# EasyEDA Pro project DRV8701驱动（最终）.eprj

# Schematic 20250211
Board Name: 20250211; Create Date: 2025-03-03; Page Name: Sheet_1; Project Name: DRV8701驱动（最终）; Schematic Name: 20250211; Update Date: 2025-03-03; Add into BOM: yes; Company: Your Company; Convert to PCB: yes; Date: 2021-11-28; Draw By: nhyxx; REV: 1.0; Sheet: 1/1
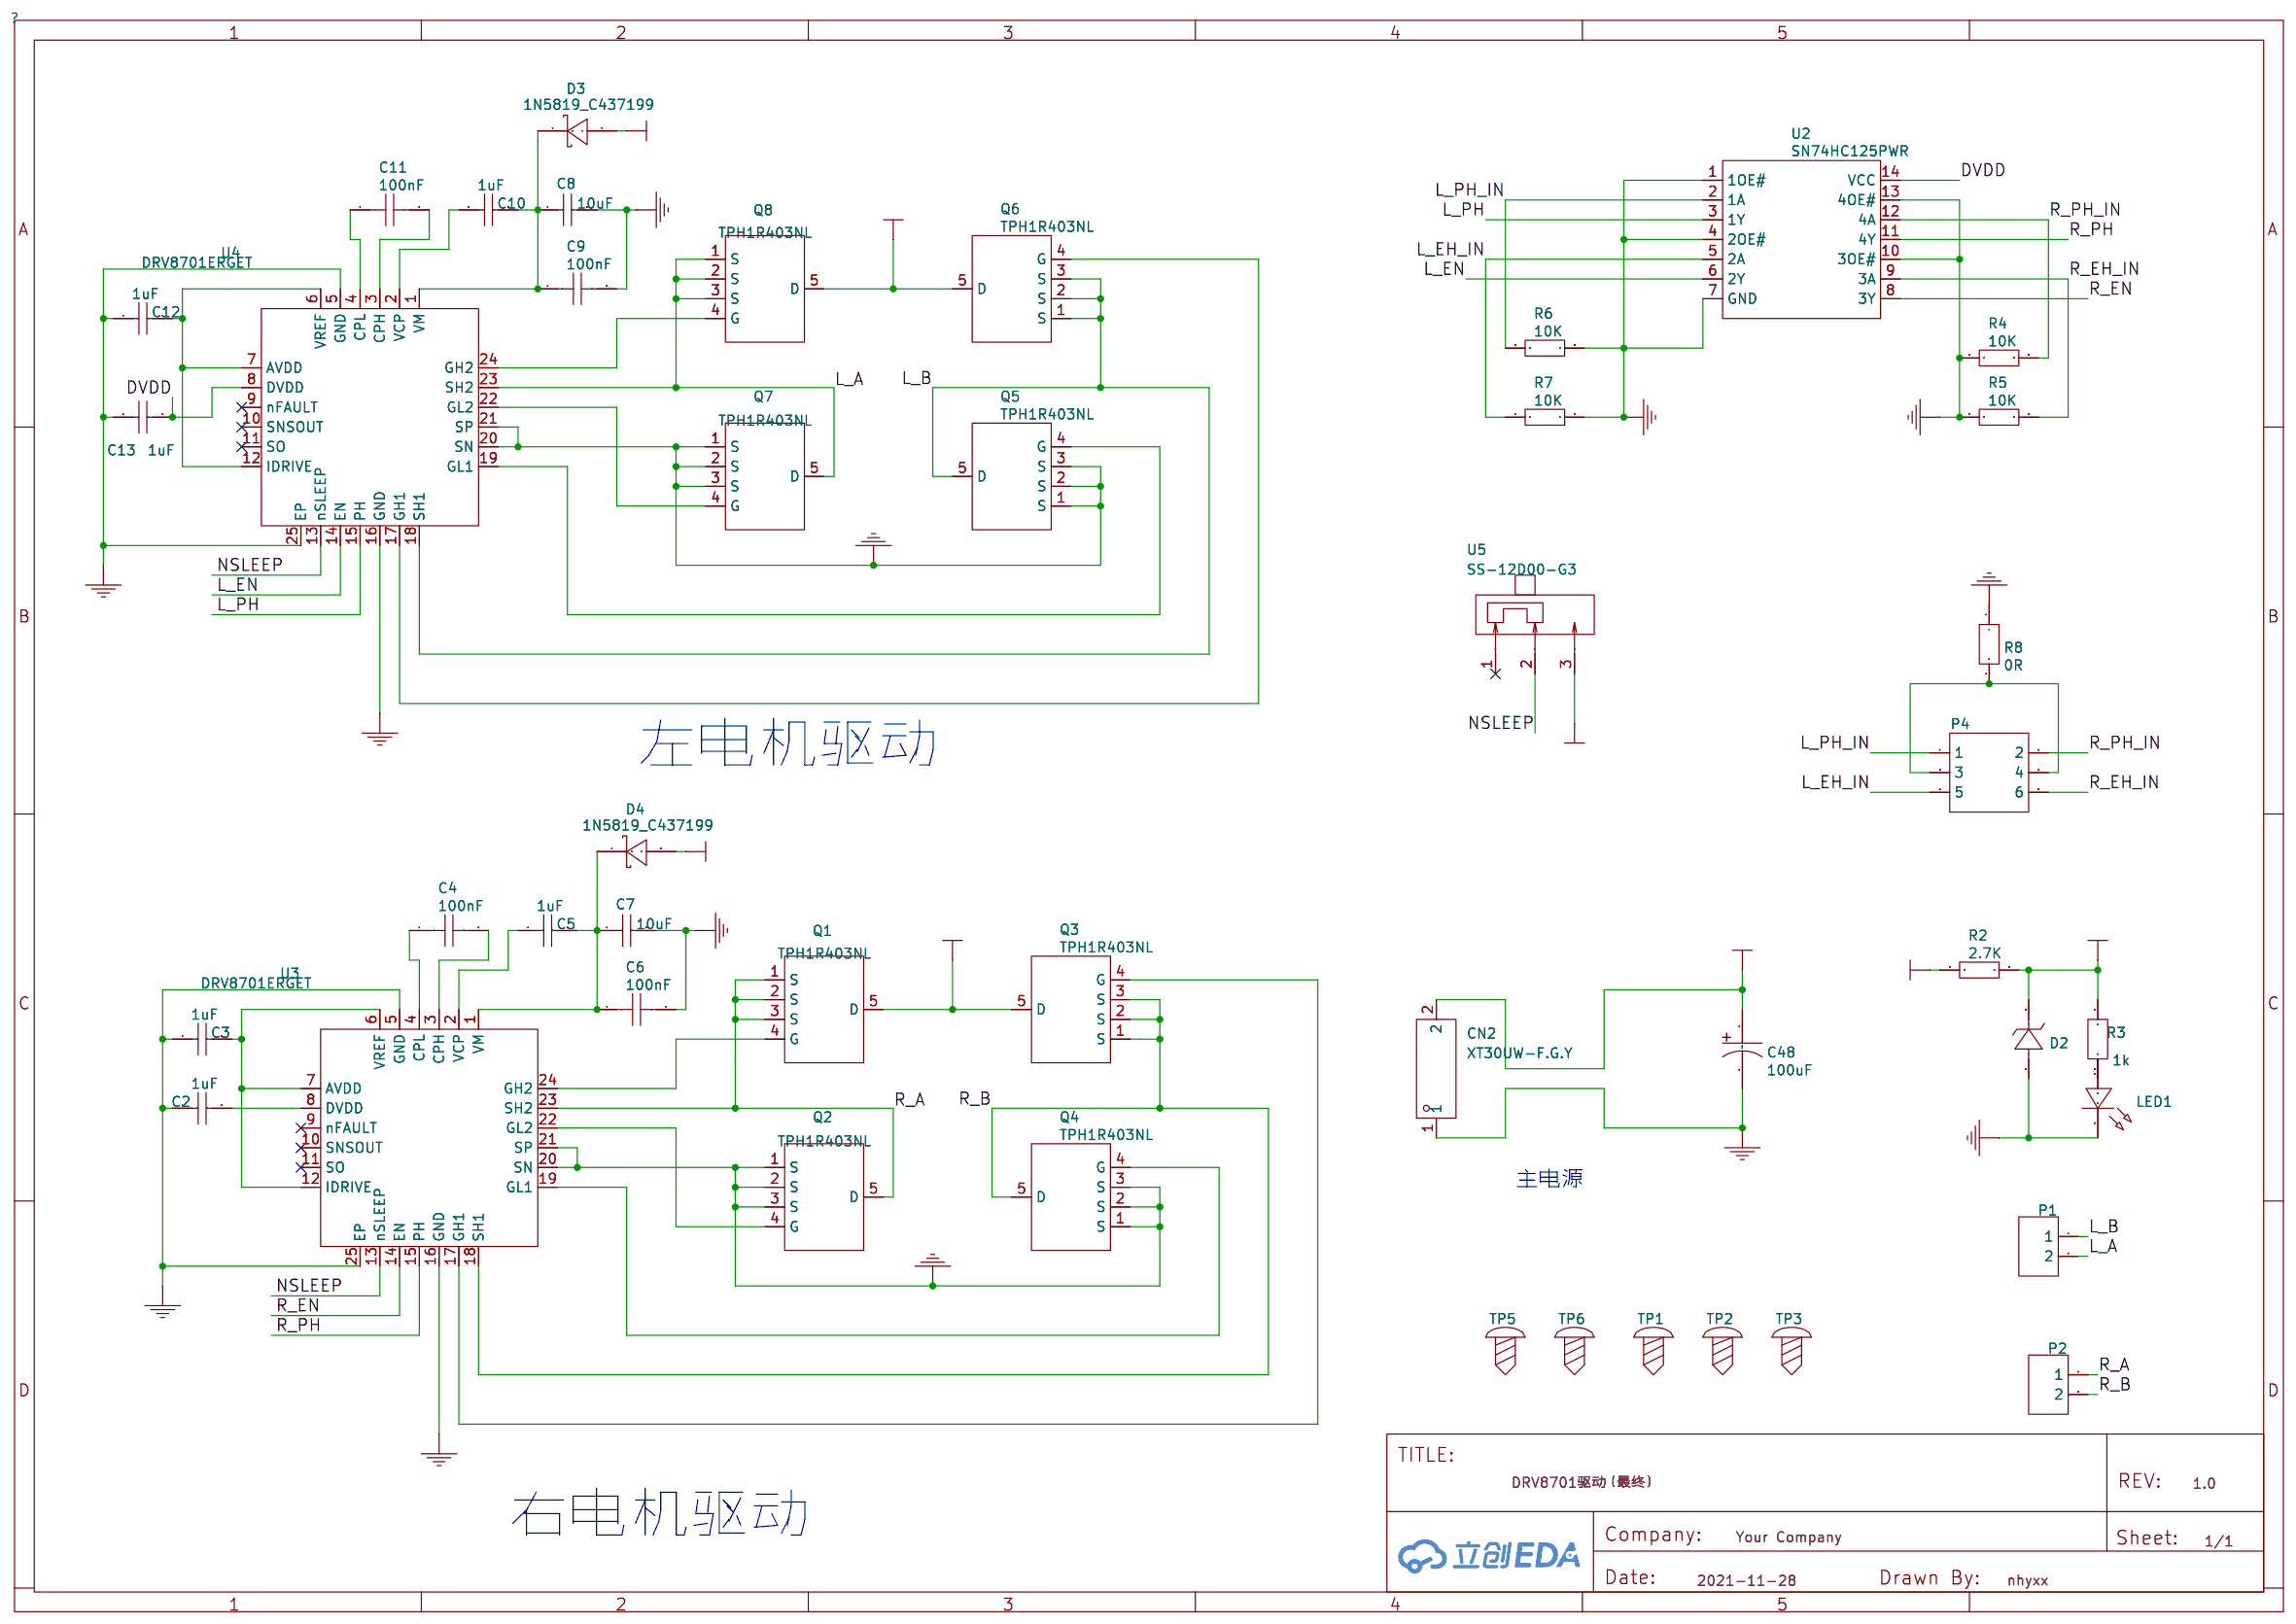
[diagram p0: schematic sheet]

## Parts
C2  1uF  [C0603]
C3  1uF  [C0603]
C4  100nF  [C0603]
C5  1uF  [C0603]
C6  100nF  [C0603]
C7  10uF  [C0603]
C8  10uF  [C0603]
C9  100nF  [C0603]
C10  1uF  [C0603]
C11  100nF  [C0603]
C12  1uF  [C0603]
C13  1uF  [C0603]
C48  100uF  [CAP-TH_BD8.0-P3.50-D1.0-FD]
CN2  XT30UW-F.G.Y  [CONN-TH_XT30UW-F.G.Y]
D2  BZT52C3V3_C908185  [SOD-123_L2.7-W1.6-LS3.7-RD]
D3  1N5819_C437199  [SMA_L4.4-W2.6-LS5.0-RD]
D4  1N5819_C437199  [SMA_L4.4-W2.6-LS5.0-RD]
LED1  LED-0805_R  [LED0603_BLUE]
P1  CONN-TH_2P-P5.00  [CONN-TH_2P-P5.00]
P2  CONN-TH_2P-P5.00  [CONN-TH_2P-P5.00]
P4  -  [HDR-TH_6P-P2.54-V-F-R2-C3-S2.54]
Q1  TPH1R403NL  [POWERVDFN-8_L6.2-W5.2-P1.27-LS6.0-BL]
Q2  TPH1R403NL  [POWERVDFN-8_L6.2-W5.2-P1.27-LS6.0-BL]
Q3  TPH1R403NL  [POWERVDFN-8_L6.2-W5.2-P1.27-LS6.0-BL]
Q4  TPH1R403NL  [POWERVDFN-8_L6.2-W5.2-P1.27-LS6.0-BL]
Q5  TPH1R403NL  [POWERVDFN-8_L6.2-W5.2-P1.27-LS6.0-BL]
Q6  TPH1R403NL  [POWERVDFN-8_L6.2-W5.2-P1.27-LS6.0-BL]
Q7  TPH1R403NL  [POWERVDFN-8_L6.2-W5.2-P1.27-LS6.0-BL]
Q8  TPH1R403NL  [POWERVDFN-8_L6.2-W5.2-P1.27-LS6.0-BL]
R2  2.7K  [R0603]
R3  1k  [R0603]
R4  10K  [R0603]
R5  10K  [R0603]
R6  10K  [R0603]
R7  10K  [R0603]
R8  0R  [R1206]
TP1  M3铜柱  [M3铜柱]
TP2  M3铜柱  [M3铜柱]
TP3  M3铜柱  [M3铜柱]
TP5  M3铜柱  [M3铜柱]
TP6  M3铜柱  [M3铜柱]
U2  SN74HC125PWR  [TSSOP-14_L5.0-W4.4-P0.65-LS6.5-BL]
U3  DRV8701ERGET  [VQFN-24_L4.0-W4.0-P0.50-LS4.0-BL-EP]
U4  DRV8701ERGET  [VQFN-24_L4.0-W4.0-P0.50-LS4.0-BL-EP]
U5  SS-12D00-G3  [SW-TH_3P-L8.8-W3.9-P2.50_SS12D00G3]

## Library data of the parts
C2 C3 C5 C10 C12 C13 = 1uF: Supplier: LCSC; Manufacturer Part: CL21F105ZOFNNNE; Manufacturer: SAMSUNG; Supplier Part: C16834
C4 C6 C9 C11 = 100nF: Supplier: LCSC; Supplier Part: C730459; Manufacturer: Samsung Electro-Mechanics; Manufacturer Part: CL21B104MBCNNNC
C7 C8 = 10uF: Supplier: LCSC; Supplier Part: C329933; Manufacturer: TDK; Manufacturer Part: C2012X5R1E106KT000N
C48 = 100uF: Supplier: LCSC; Supplier Part: C171434; Manufacturer: Aihua Group; Manufacturer Part: SPZ1HM101F09O00RAXXX; Paste Type: expand
CN2 = XT30UW-F.G.Y: LCSC Part Name: XT30UW防水锁扣镀金15A二芯母插头; Supplier Part: C19268025; Manufacturer: AMASS(艾迈斯); JLCPCB Part Class: 扩展库; Datasheet: https://atta.szlcsc.com/upload/public/pdf/source/20231221/78A47C12D57CEEC1F37EAB36F210ACCA.pdf; Supplier: LCSC
D2 = BZT52C3V3_C908185: Supplier: LCSC; Supplier Part: C908185; Manufacturer: FUXINSEMI; Manufacturer Part: BZT52C3V3
D3 D4 = 1N5819_C437199: Supplier: LCSC; Supplier Part: C437199; Manufacturer: KEXIN; Manufacturer Part: 1N5819; JLCPCB Part Class: Extend; JLCPCB SMD: Yes
LED1 = LED-0805_R: Manufacturer: EVERLIGHT(台湾亿光); Manufacturer Part: 17-21SURC/S530-A3/TR8; Supplier Part: C72037
P1 P2 = CONN-TH_2P-P5.00: Supplier: LCSC
P4 = HDR-F_2.54_2x3: Supplier Part: C92272; Supplier Footprint: 插件
Q1-Q8 = TPH1R403NL: Supplier: LCSC; Manufacturer: TOSHIBA; Supplier Part: C83440; JLCPCB Part Class: Extend; JLCPCB SMD: Yes
R2 = 2.7K: Supplier: LCSC; Manufacturer: UniOhm; Manufacturer Part: 0805W8F2701T5E; Supplier Part: C17530; JLCPCB Part Class: Basic; JLCPCB SMD: Yes
R3 = 1k
R4-R7 = 10K: Supplier: LCSC; Supplier Part: C328719; Manufacturer: SUSUMU; Manufacturer Part: RG2012P-103-B-T5
R8 = 0R
TP1-TP3 TP5 TP6 = M3铜柱
U2 = SN74HC125PWR: Supplier: LCSC; Supplier Part: C132994; Manufacturer: Texas Instruments; JLCPCB Part Class: Extend; JLCPCB SMD: Yes
U3 U4 = DRV8701ERGET: Supplier: LCSC; Manufacturer: TI; Supplier Part: C132049; JLCPCB Part Class: Extend; JLCPCB SMD: Yes
U5 = SS-12D00-G3: 操作正拨 插件立式 尺寸大型 两档位; Supplier Part: C22355741; Manufacturer: SOFNG(硕方); Supplier Footprint: 插件-3P,8.8x3.9mm; JLCPCB Part Class: 扩展库; Datasheet: https://atta.szlcsc.com/upload/public/pdf/source/20240529/1037A069FE9BBCECE56007AB916D4384.pdf; Supplier: LCSC

## Nets
3V3: D2.1(K) R2.2 R3.1 U5.3
DVDD: C13.2 U2.14(VCC) U4.8(DVDD)
GND: C2.1 C3.1 C6.2 C7.2 C8.2 C9.2 C12.1 C13.1 C48.2 CN2.1 D2.2(A) LED1.2 Q2.1(S) Q2.2(S) Q2.3(S) Q4.1(S) Q4.2(S) Q4.3(S) Q5.1(S) Q5.2(S) Q5.3(S) Q7.1(S) Q7.2(S) Q7.3(S) R4.1 R5.1 R6.2 R7.2 R8.1 U2.1(1OE#) U2.4(2OE#) U2.7(GND) U2.10(3OE#) U2.13(4OE#) U3.5(GND) U3.16(GND) U3.20(SN) U3.21(SP) U3.25(EP) U4.5(GND) U4.16(GND) U4.20(SN) U4.21(SP) U4.25(EP)
L_A: P1.2 Q7.5(D) Q8.1(S) Q8.2(S) Q8.3(S) U4.23(SH2)
L_B: P1.1 Q5.5(D) Q6.1(S) Q6.2(S) Q6.3(S) U4.18(SH1)
L_EH_IN: P4.5 R7.1 U2.5(2A)
L_EN: U2.6(2Y) U4.14(EN)
L_PH: U2.3(1Y) U4.15(PH)
L_PH_IN: P4.1 R6.1 U2.2(1A)
NSLEEP: U3.13(nSLEEP) U4.13(nSLEEP) U5.2
R_A: P2.1 Q1.1(S) Q1.2(S) Q1.3(S) Q2.5(D) U3.23(SH2)
R_B: P2.2 Q3.1(S) Q3.2(S) Q3.3(S) Q4.5(D) U3.18(SH1)
R_EH_IN: P4.6 R5.2 U2.9(3A)
R_EN: U2.8(3Y) U3.14(EN)
R_PH: U2.11(4Y) U3.15(PH)
R_PH_IN: P4.2 R4.2 U2.12(4A)
VM: C48.1 CN2.2 D3.2(A) D4.2(A) Q1.5(D) Q3.5(D) Q6.5(D) Q8.5(D) R2.1
$1N18: Q8.4(G) U4.24(GH2)
$1N20: Q7.4(G) U4.22(GL2)
$1N30: Q5.4(G) U4.19(GL1)
$1N31: Q6.4(G) U4.17(GH1)
$1N38: C12.2 U4.6(VREF) U4.7(AVDD) U4.12(IDRIVE)
$1N40: C11.1 U4.4(CPL)
$1N41: C11.2 U4.3(CPH)
$1N42: C10.1 U4.2(VCP)
$1N43: C8.1 C9.1 C10.2 D3.1(C) U4.1(VM)
$1N47: C5.2 C6.1 C7.1 D4.1(C) U3.1(VM)
$1N49: C5.1 U3.2(VCP)
$1N50: C4.2 U3.3(CPH)
$1N51: C4.1 U3.4(CPL)
$1N53: C3.2 U3.6(VREF) U3.7(AVDD) U3.12(IDRIVE)
$1N54: C2.2 U3.8(DVDD)
$1N59: Q3.4(G) U3.17(GH1)
$1N61: Q4.4(G) U3.19(GL1)
$1N70: Q2.4(G) U3.22(GL2)
$1N71: Q1.4(G) U3.24(GH2)
$1N75: LED1.1 R3.2
$1N2212: P4.3 P4.4 R8.2

Not connected (* = marked no-connect by the designer): U3 9(nFAULT)* 10(SNSOUT)* 11(SO)*; U4 9(nFAULT)* 10(SNSOUT)* 11(SO)*; U5 1*

## Notes on the sheet
- 左电机驱动
- 主电源
- 右电机驱动

# Board PCB_2-12
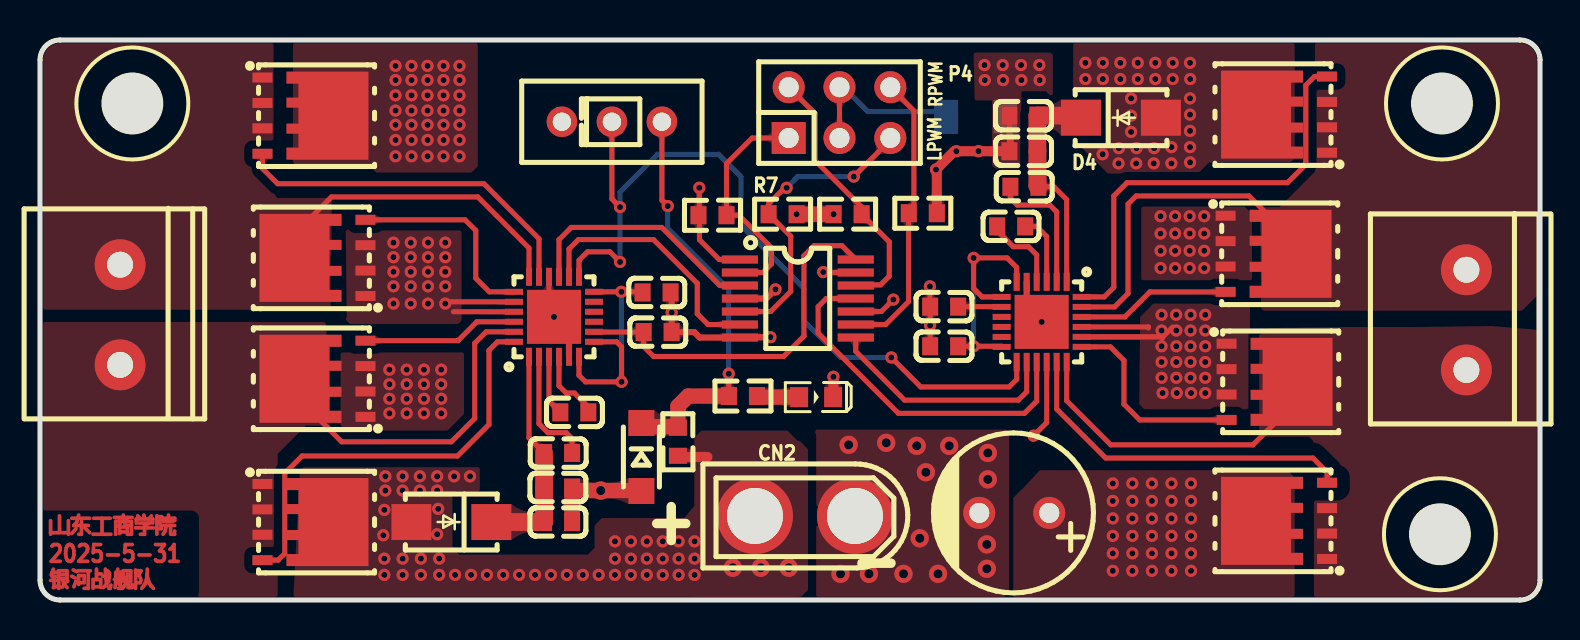
[diagram p1: board, top side]
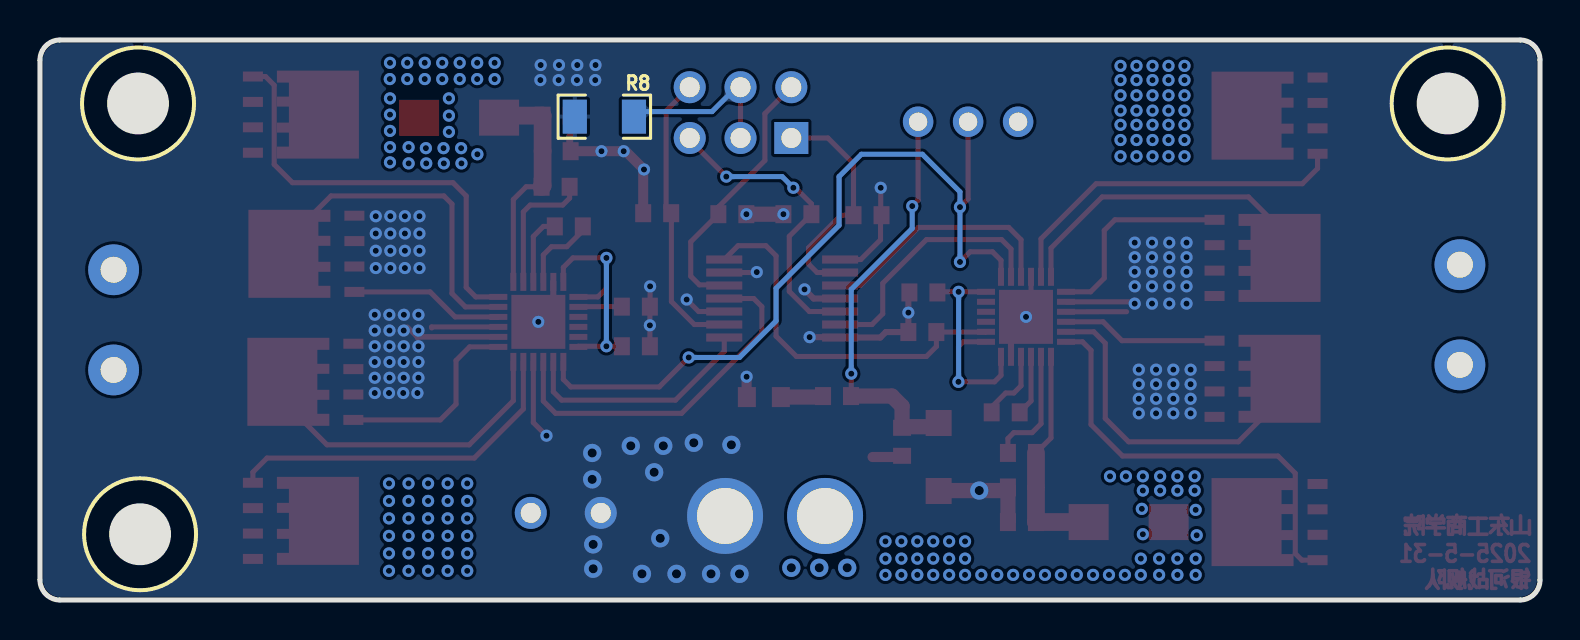
[diagram p2: board, bottom side, seen from below]

Outline 75 x 28 mm; copper layers: Top Layer, Inner1, Inner2, Bottom Layer. Coordinates in mm from the lower left corner of the outline.
Outline path: 0,27 0,1 arc(0.29,0.29) 1,0 74,0 arc(74.71,0.29) 75,1 75,27 arc(74.71,27.71) 74,28 1,28 arc(0.29,27.71) 0,27
Stack: Top Layer 0.035mm / Dielectric1 0.48mm PP er 4.5 / Inner1 0.035mm / Dielectric2 0.48mm FR4 er 4.5 / Inner2 0.035mm / Dielectric3 0.48mm PP er 4.5 / Bottom Layer 0.035mm

## Design rules (mm)
spacing Default (default): track to track 0.152, other pairs 0 to 0.152
track width Default (default): min 0.254, default 0.254, max 25.4
differential pair differentialPair (default): width min 0.127, default 0.254, max 2.54; gap min 0.152, default 0.152
via Default (default): diameter min 0.61, default 0.61, max 100.025; hole min 0.305, default 0.305, max 59.995
pour e34 uses gge43599
pour e36 uses gge43605
pour e38 uses gge43593
pour e435 uses gge4859
pour e437 uses gge4979
pour e439 uses gge5889
pour e441 uses gge6201
pour e443 uses gge6205
pour e445 uses gge6367
pour e447 uses gge6451
pour e449 uses gge6710
pour e451 uses gge7214
pour e453 uses gge8108
pour e455 uses gge8115
pour e457 uses gge17115
pour e459 uses gge17680
pour e461 uses gge18781
pour e466 uses gge43533

## Placement (name value [footprint] x y rotation side)
C2  1uF  [C0603]  45.21 14.67 0 top
C3  1uF  [C0603]  45.21 12.69 0 top
C4  100nF  [C0603]  48.56 18.68 0 top
C5  1uF  [C0603]  49.22 20.66 0 top
C6  100nF  [C0603]  49.17 24.22 180 top
C7  10uF  [C0603]  49.17 22.44 180 top
C8  10uF  [C0603]  25.9 3.9 0 top
C9  100nF  [C0603]  25.9 5.62 0 top
C10  1uF  [C0603]  25.9 7.35 180 top
C11  100nF  [C0603]  26.71 9.38 180 top
C12  1uF  [C0603]  30.83 15.38 180 top
C13  1uF  [C0603]  30.88 13.4 180 top
C48  100uF  [CAP-TH_BD8.0-P3.50-D1.0-FD]  48.71 4.36 180 top
CN2  XT30UW-F.G.Y  [CONN-TH_XT30UW-F.G.Y]  38.25 4.2 180 top
D2  BZT52C3V3_C908185  [SOD-123_L2.7-W1.6-LS3.7-RD]  30.07 7.15 270 top
D3  1N5819_C437199  [SMA_L4.4-W2.6-LS5.0-RD]  20.57 3.9 180 top
D4  1N5819_C437199  [SMA_L4.4-W2.6-LS5.0-RD]  54.05 24.12 0 top
LED1  LED-0805_R  [LED0603_BLUE]  38.81 10.14 0 top
P1  -  [CONN-TH_2P-P5.00]  4 14.26 270 top
P2  -  [CONN-TH_2P-P5.00]  71.32 14.01 270 top
P4  -  [HDR-TH_6P-P2.54-V-F-R2-C3-S2.54]  39.97 24.37 0 top
Q1  TPH1R403NL  [POWERVDFN-8_L6.2-W5.2-P1.27-LS6.0-BL]  62.58 24.27 90 top
Q2  TPH1R403NL  [POWERVDFN-8_L6.2-W5.2-P1.27-LS6.0-BL]  61.05 17.31 270 top
Q3  TPH1R403NL  [POWERVDFN-8_L6.2-W5.2-P1.27-LS6.0-BL]  62.58 3.96 90 top
Q4  TPH1R403NL  [POWERVDFN-8_L6.2-W5.2-P1.27-LS6.0-BL]  61.11 10.91 270 top
Q5  TPH1R403NL  [POWERVDFN-8_L6.2-W5.2-P1.27-LS6.0-BL]  14.5 17.11 90 top
Q6  TPH1R403NL  [POWERVDFN-8_L6.2-W5.2-P1.27-LS6.0-BL]  12.9 24.22 270 top
Q7  TPH1R403NL  [POWERVDFN-8_L6.2-W5.2-P1.27-LS6.0-BL]  14.5 11.06 90 top
Q8  TPH1R403NL  [POWERVDFN-8_L6.2-W5.2-P1.27-LS6.0-BL]  12.9 3.9 270 top
R2  2.7K  [R0603]  31.9 7.91 90 top
R3  1k  [R0603]  35.15 10.2 0 top
R4  10K  [R0603]  40.38 19.29 0 top
R5  10K  [R0603]  44.14 19.34 180 top
R6  10K  [R0603]  33.62 19.24 180 top
R7  10K  [R0603]  37.13 19.29 0 top
R8  0R  [R1206]  46.78 24.17 180 bottom
TP2  -  [M3铜柱]  70 3.29 0 top
TP3  -  [M3铜柱]  4.62 24.83 0 top
TP5  -  [M3铜柱]  70.1 24.83 0 top
U2  SN74HC125PWR  [TSSOP-14_L5.0-W4.4-P0.65-LS6.5-BL]  37.89 15.07 270 top
U3  DRV8701ERGET  [VQFN-24_L4.0-W4.0-P0.50-LS4.0-BL-EP]  50.08 13.91 180 top
U4  DRV8701ERGET  [VQFN-24_L4.0-W4.0-P0.50-LS4.0-BL-EP]  25.7 14.16 0 top
U5  SS-12D00-G3  [SW-TH_3P-L8.8-W3.9-P2.50_SS12D00G3]  28.59 23.91 0 top

## Footprints (pads in the part's own frame, mm; a bottom-side part is the same pattern mirrored in y, then rotated)
C0603
  rect 0.8x0.9 smd: 1(-0.7,0) 2(0.7,0)
CAP-TH_BD8.0-P3.50-D1.0-FD
  round 1.6 hole 1: 1(-1.75,0) 2(1.75,0)
CONN-TH_2P-P5.00
  round 2.54 hole 1.3: 1(-2.505,0) 2(2.505,0)
CONN-TH_XT30UW-F.G.Y
  round 3.8 hole 2.8: 1(-2.5,0) 2(2.5,0)
HDR-TH_6P-P2.54-V-F-R2-C3-S2.54
  rect 1.7x1.6 hole 1: 1(-2.54,-1.27)
  round 1.6 hole 1: 2(-2.54,1.27) 3(0,-1.27) 4(0,1.27) 5(2.54,-1.27) 6(2.54,1.27)
LED0603_BLUE
  rect 0.9x1 smd: 1(-0.85,0) 2(0.85,0)
POWERVDFN-8_L6.2-W5.2-P1.27-LS6.0-BL
  rect 0.5x1 smd: 1(-1.905,-1.775) 2(-0.635,-1.775) 3(0.635,-1.775) 4(1.905,-1.775)
  custom 4.4x4.1 smd: 5(0,1.775)
R0603
  rect 0.8x0.9 smd: 1(-0.7,0) 2(0.7,0)
R1206
  rect 1.208x1.701 smd: 1(-1.479,0) 2(1.479,0)
SMA_L4.4-W2.6-LS5.0-RD
  rect 2x1.8 smd: 1(-2,0) 2(2,0)
SOD-123_L2.7-W1.6-LS3.7-RD
  rect 1.3x1.3 smd: 1(-1.7,0) 2(1.7,0)
SW-TH_3P-L8.8-W3.9-P2.50_SS12D00G3
  round 1.524 hole 0.914: 1(-2.5,0) 2(0,0) 3(2.5,0)
TSSOP-14_L5.0-W4.4-P0.65-LS6.5-BL
  rect 0.406x1.804 smd: 1(-1.95,-2.896) 2(-1.3,-2.896) 3(-0.65,-2.896) 4(0,-2.896) 5(0.65,-2.896) 6(1.3,-2.896) 7(1.95,-2.896) 8(1.95,2.896) 9(1.3,2.896) 10(0.65,2.896) 11(0,2.896) 12(-0.65,2.896) 13(-1.3,2.896) 14(-1.95,2.896)
VQFN-24_L4.0-W4.0-P0.50-LS4.0-BL-EP
  rect 0.3x0.9 smd: 1(-1.25,-2) 2(-0.75,-2) 3(-0.251,-2) 4(0.25,-2) 5(0.75,-2) 6(1.25,-2) 13(1.25,2) 14(0.749,2) 15(0.249,2) 16(-0.251,2) 17(-0.75,2) 18(-1.25,2)
  rect 0.9x0.3 smd: 7(2.001,-1.25) 8(2.001,-0.75) 9(2.001,-0.249) 10(2.001,0.251) 11(2.001,0.752) 12(2.001,1.25) 19(-2.001,1.25) 20(-2.001,0.75) 21(-2.001,0.251) 22(-2.001,-0.248) 23(-2.001,-0.749) 24(-2.001,-1.249)
  rect 2.7x2.7 smd: 25(0.001,-0.002)

## Nets
As in the schematic.

Pads without a net: U3 9 10 11; U4 9 10 11; U5 1

## Via types
v1: diameter 0.914, hole 0.457, Top Layer to Bottom Layer, 18 vias
v2: diameter 0.61, hole 0.305, Top Layer to Bottom Layer, 258 vias

## Routing (per net, layer and track width the routed paths; a pad name or vN(x,y) marks a point on that pad's centre or on a via; arc(x,y) is an arc through that point)
3V3: length 20.8
  Top Layer w0.254: v2(31.39,19.7) 31.09,19.99 U5.3 ; v2(34.44,11.31) 34.44,10.24 34.39,10.2
  Top Layer w0.762: 34.39,10.2 32.4,10.2 31.9,9.69 ; 31.9,9.69 31.9,8.66 30.25,8.66 D2.1
  Bottom Layer w0.254: v2(31.39,19.7) 31.39,18.58 34.44,15.53 v2(34.44,11.31)
DVDD: length 18.9
  Top Layer w0.254: U4.8 27.71,13.4 C13.2 30.18,12.68 30.68,12.18 37.18,12.18 38.2,13.19 38.2,17.21 38.7,17.72 40.1,17.72 U2.14
GND: length 67.2
  Top Layer w0.254: U2.10 42.07,14.42 v2(42.67,15.02) ; 48.47,24.22 48.47,22.44 48.56,22.53 48.56,23.2 ; 25.45,16.16 25.45,14.41 v2(25.7,14.16) ; v2(49.68,8.22) 50.33,8.87 50.33,11.91 ; U2.13 39.18,16.37 v2(39.16,16.39) ; 23.7,14.91 20.26,14.91 v2(20.26,14.82) ; 56.13,13.09 56.13,13.16 U3.20 56.14,13.16 56.64,13.65 ; 44.51,12.69 v2(44.51,13.73) 44.51,14.67 44.49,14.68 v2(44.49,15.68) ; U3.21 55.42,13.65 55.42,13.6 ; v2(32.96,20.61) 32.96,19.5 32.97,19.49 32.97,18.01 33.96,17.02 U2.1 ; 23.7,14.41 20.67,14.41
  Top Layer w0.305: U3.5 49.33,14.66 v2(50.08,13.91) ; 31.53,15.38 31.58,15.33 v2(31.58,14.37) 31.58,13.4 32.71,13.4 32.98,13.12 U2.7 35.02,13.14 v2(36.52,13.14) ; v2(36.77,15.53) 36.32,15.07 U2.4 ; v2(25.7,14.16) 26.45,13.41 26.45,12.16
  Top Layer w0.5: 48.47,22.44 v2(46.93,22.44) v2(45.82,22.44) 45.71,22.44 v2(44.8,21.52) 44.84,21.48 44.84,19.39
  Top Layer w0.508: v2(39.67,11.16) 39.67,10.16 39.66,10.15
  Top Layer w0.762: 30.07,5.45 30.05,5.47 v1(28.04,5.47) 26.76,5.47 26.6,5.62 26.6,3.9 ; v2(37.83,19.29) v2(39.68,19.29)
  vias: v1(40.02,1.31) v1(40.43,7.76) v1(41.45,1.31) v1(42.31,7.86) v1(43.17,1.31) v1(43.83,7.71) v1(43.99,3.08) v1(44.29,6.39) v1(44.9,1.31) v1(45.46,7.71) v1(47.39,7.35) v1(47.39,6.03) v1(47.34,2.78) v1(47.34,1.56) v2(17.47,11.52) v2(17.47,10.79) v2(17.47,10.06) v2(17.47,9.33) v2(17.67,17.87) v2(17.67,17.14) v2(17.67,16.41) v2(17.67,15.68) v2(17.67,14.82) v2(18.33,11.52) v2(18.33,10.79) v2(18.33,10.06) v2(18.33,9.33) v2(18.54,17.87) v2(18.54,17.14) v2(18.54,16.41) v2(18.54,15.68) v2(18.54,14.82) v2(19.2,11.52) v2(19.2,10.79) v2(19.2,10.06) v2(19.2,9.33) v2(19.4,17.87) v2(19.4,17.14) v2(19.4,16.41) v2(19.4,15.68) v2(19.4,14.82) v2(20.06,11.52) v2(20.06,10.79) v2(20.06,10.06) v2(20.06,9.33) v2(20.26,17.87) v2(20.26,17.14) v2(20.26,16.41) v2(20.26,15.68) v2(47.22,26.75) v2(47.24,26) v2(48.14,26.75) v2(48.15,26) v2(49.05,26.75) v2(49.07,26) v2(49.97,26.75) v2(49.98,26) v2(56.03,19.19) v2(56.03,18.33) v2(56.03,17.46) v2(56.03,16.6) v2(56.08,14.26) v2(56.08,13.47) v2(56.08,12.69) v2(56.08,11.9) v2(56.08,11.11) v2(56.13,10.35) v2(56.75,19.19) v2(56.75,18.33) v2(56.75,17.46) v2(56.75,16.6) v2(56.81,14.26) v2(56.81,13.47) v2(56.81,12.69) v2(56.81,11.9) v2(56.81,11.11) v2(56.84,10.35) v2(57.48,19.19) v2(57.48,18.33) v2(57.48,17.46) v2(57.48,16.6) v2(57.53,14.26) v2(57.53,13.47) v2(57.53,12.69) v2(57.53,11.9) v2(57.53,11.11) v2(57.55,10.35) v2(58.21,19.19) v2(58.21,18.33) v2(58.21,17.46) v2(58.21,16.6) v2(58.26,14.26) v2(58.26,13.47) v2(58.26,12.69) v2(58.26,11.9) v2(58.26,11.11) v2(58.26,10.35)
L_A: length 17.2
  Top Layer w0.254: 12.72,11.06 12.72,10.27 15.08,7.91 20.57,7.91 21.74,9.08 21.74,12.84 22.31,13.41 23.7,13.41
L_B: length 16.2
  Top Layer w0.254: 12.72,17.11 12.72,18.3 14.57,20.15 21.89,20.15 24.45,17.59 24.45,16.16
L_EH_IN: length 15.3
  Top Layer w0.254: P4.5 42.51,23 v2(40.69,21.17) ; v2(37.33,20.61) 37.23,20.61 36.43,19.81 R7.1 37.54,18.18 37.54,15.43 36.53,14.42 U2.5
  Bottom Layer w0.254: v2(37.33,20.61) 37.89,21.17 v2(40.69,21.17)
L_EN: length 12.8
  Top Layer w0.254: 26.45,16.16 26.45,17.55 26.92,18.02 30.68,18.02 32.86,15.84 32.86,14.31 33.4,13.77 35,13.77
L_PH: length 12.4
  Top Layer w0.254: 25.95,16.16 25.95,18.02 26.56,18.63 31.08,18.63 33.99,15.72 U2.3
L_PH_IN: length 11.7
  Top Layer w0.254: U2.2 36.14,16.37 36.57,16.8 36.57,17.61 34.94,19.24 R6.1 34.32,21.82 35.61,23.1 P4.1
NSLEEP: length 40
  Top Layer w0.254: v2(29,19.65) 28.59,20.05 U5.2 ; v2(42.56,12.13) 44.04,10.65 48.46,10.65 48.83,11.03 48.83,11.91 ; 26.95,16.16 26.95,16.98 27.38,17.41 28.49,17.41 v2(29,16.9)
  Bottom Layer w0.254: v2(29,16.9) v2(29,19.65) 29,20.41 30.88,22.29 33.93,22.29 35.05,21.17 35.05,18.73 38.2,15.58 38.2,13.96 40.02,12.13 v2(42.56,12.13)
R_A: length 17.2
  Top Layer w0.254: U3.23 53.73,14.65 54.4,15.33 54.4,19.8 54.81,20.2 60.45,20.2 62.83,17.82 62.83,17.31
R_B: length 16.2
  Top Layer w0.254: 51.33,11.91 51.33,9.96 53.54,7.76 60.65,7.76 62.88,9.99 62.88,10.91
R_EH_IN: length 14.4
  Top Layer w0.254: P4.6 43.69,24.46 43.69,19.59 R5.2 43.43,19.33 43.43,14.92 42.28,13.77 U2.9
R_EN: length 11.9
  Top Layer w0.254: 49.33,11.91 49.33,10.41 48.91,9.99 43.23,9.99 40.79,12.43 U2.8
R_PH: length 18.2
  Top Layer w0.254: 49.83,11.91 49.83,9.95 49.22,9.33 42.92,9.33 38.91,13.35 38.91,14.67 39.31,15.07 U2.11
R_PH_IN: length 13.4
  Top Layer w0.254: U2.12 40.82,15.76 42.03,15.76 42.46,16.19 42.46,17.91 R4.2 41.08,19.65 38.75,21.97 38.75,24.32 P4.2
VM: length 1.5
  Top Layer w0.508: 33.37,7.15 31.9,7.15 31.9,7.16
  vias: v1(34.64,1.61) v1(36.04,1.61) v1(37.43,1.61) v2(17.22,4.51) v2(17.16,3.24) v2(17.22,2.07) v2(17.22,1.26) v2(17.27,6.18) v2(17.27,5.47) v2(17.77,26.71) v2(17.77,26) v2(17.77,25.23) v2(17.77,24.47) v2(17.77,23.76) v2(17.77,23) v2(17.77,22.19) v2(18.13,6.18) v2(18.13,5.47) v2(18.13,2.07) v2(18.13,1.26) v2(18.57,26.71) v2(18.57,26) v2(18.57,25.23) v2(18.57,24.47) v2(18.57,23.76) v2(18.57,23) v2(18.57,22.19) v2(18.99,6.18) v2(18.99,5.47) v2(19.04,2.07) v2(19.04,1.26) v2(19.37,26.71) v2(19.37,26) v2(19.37,25.23) v2(19.37,24.47) v2(19.37,23.76) v2(19.37,23) v2(19.37,22.19) v2(19.86,6.18) v2(19.86,5.47) v2(19.91,4.56) v2(19.86,3.29) v2(19.96,2.07) v2(19.96,1.26) v2(20.17,26.71) v2(20.17,26) v2(20.17,25.23) v2(20.17,24.47) v2(20.17,23.76) v2(20.17,23) v2(20.17,22.19) v2(20.7,6.18) v2(20.75,1.26) v2(20.97,26.71) v2(20.97,26) v2(20.97,25.23) v2(20.97,24.47) v2(20.97,23.76) v2(20.97,23) v2(20.97,22.19) v2(21.5,6.18) v2(21.55,1.26) v2(22.35,1.26) v2(23.16,1.26) v2(23.95,1.26) v2(24.75,1.26) v2(25.55,1.26) v2(26.34,1.26) v2(27.14,1.26) v2(27.93,1.26) v2(28.75,2.93) v2(28.75,2.07) v2(28.75,1.26) v2(29.54,2.93) v2(29.54,2.07) v2(29.54,1.26) v2(30.34,2.93) v2(30.34,2.07) v2(30.34,1.26) v2(31.13,2.93) v2(31.13,2.07) v2(31.13,1.26) v2(31.93,2.93) v2(31.93,2.07) v2(31.93,1.26) v2(32.73,2.93) v2(32.73,2.07) v2(32.73,1.26) v2(52.27,26.86) v2(52.27,26.05) v2(53.13,22.29) v2(53.14,26.86) v2(53.14,26.05) v2(53.64,5.83) v2(53.64,4.95) v2(53.64,4.08) v2(53.64,3.21) v2(53.64,2.33) v2(53.64,1.46) v2(53.93,21.83) v2(54.02,26.86) v2(54.02,26.05) v2(53.94,22.59) v2(54.55,25.08) v2(54.55,24.22) v2(54.55,23.41) v2(54.62,5.83) v2(54.62,4.95) v2(54.62,4.08) v2(54.62,3.21) v2(54.62,2.33) v2(54.62,1.46) v2(54.82,22.59) v2(54.81,21.83) v2(54.89,26.86) v2(54.89,26.05) v2(55.6,5.83) v2(55.6,4.95) v2(55.6,4.08) v2(55.6,3.21) v2(55.6,2.33) v2(55.6,1.46) v2(55.7,22.59) v2(55.69,21.83) v2(55.76,26.86) v2(55.76,26.05) v2(56.64,26.86) v2(56.64,26.05) v2(56.57,22.64) v2(56.57,21.83) v2(56.57,5.83) v2(56.57,4.95) v2(56.57,4.08) v2(56.57,3.21) v2(56.57,2.33) v2(56.57,1.46) v2(57.5,26.86) v2(57.51,26.05) v2(57.5,25.08) v2(57.5,24.27) v2(57.5,23.46) v2(57.5,22.64) v2(57.5,21.88) v2(57.55,5.83) v2(57.55,4.95) v2(57.55,4.08) v2(57.55,3.21) v2(57.55,2.33) v2(57.55,1.46)
$1N18: length 21.6
  Top Layer w0.254: 23.7,12.91 22.87,12.91 22.45,12.48 22.45,8.77 20.87,7.2 13.1,7.2 12.24,6.34 12.24,2.32 11.91,1.99 11.12,1.99
$1N20: length 7.8
  Top Layer w0.254: 16.27,12.97 20.9,12.97 21.84,13.91 23.7,13.91
$1N30: length 10.3
  Top Layer w0.254: 16.27,19.01 21.25,19.01 21.79,18.48 21.79,16.09 22.47,15.41 23.7,15.41
$1N31: length 17.9
  Top Layer w0.254: 11.12,22.31 11.12,21.57 11.88,20.81 22.19,20.81 24.95,18.06 24.95,16.16
$1N38: length 13.4
  Top Layer w0.254: U4.7 28.83,12.91 29.08,12.66 v2(29.08,10.91) 27.27,10.91 26.95,11.23 U4.6 ; 27.7,15.41 v2(29.07,15.41) 30.1,15.41 C12.2
  Bottom Layer w0.254: v2(29.07,15.41) 29.07,10.92 v2(29.08,10.91)
$1N40: length 3.6
  Top Layer w0.254: C11.1 27.42,9.65 26.71,10.35 26.31,10.35 25.95,10.71 25.95,12.16
$1N41: length 3
  Top Layer w0.254: U4.3 25.45,9.95 26.01,9.38
$1N42: length 6
  Top Layer w0.254: 26.6,7.35 26.6,8.07 26.31,8.37 25.39,8.37 24.95,8.81 U4.2
$1N43: length 11.2
  Top Layer w0.254: U4.1 24.45,8.1 25.2,7.35
  Top Layer w0.889: D3.1 25.2,3.9 25.2,7.35
$1N47: length 11.7
  Top Layer w0.254: U3.1 51.33,20.02 50.69,20.66 C5.2
  Top Layer w0.889: 52.2,24.22 49.87,24.22 49.87,20.71 C5.2
$1N49: length 6.7
  Top Layer w0.254: C5.1 48.52,20.09 48.86,19.75 50.49,19.75 50.83,19.4 50.83,15.9
$1N50: length 3.6
  Top Layer w0.254: C4.2 49.83,18.68 50.33,18.17 50.33,15.9
$1N51: length 4
  Top Layer w0.254: U3.4 49.83,17.25 49.42,17.66 48.66,17.66 47.86,18.47 47.86,18.68
$1N53: length 12.8
  Top Layer w0.254: 48.08,12.66 48.08,12.69 v2(46.68,12.69) 45.91,12.69 ; U3.6 48.83,16.63 48.36,17.11 v2(46.68,17.11) 46.68,15.58 47.11,15.16 48.08,15.16
  Bottom Layer w0.254: v2(46.68,12.69) v2(46.68,17.11)
$1N54: length 2.2
  Top Layer w0.254: 48.08,14.65 48.07,14.67 45.91,14.67
$1N59: length 17.7
  Top Layer w0.254: 50.83,11.91 50.83,9.55 53.28,7.1 63.65,7.1 64.36,6.39 64.36,5.86
$1N61: length 10
  Top Layer w0.254: 59.33,9 54.99,9 54.2,9.79 54.2,11.97 53.52,12.66 U3.19
$1N70: length 7.7
  Top Layer w0.254: U3.22 54.24,14.15 55.49,15.4 Q2.4
$1N71: length 21.8
  Top Layer w0.254: 64.36,26.17 63.72,26.17 63.29,25.74 63.29,21.78 62.38,20.86 54.35,20.86 53.69,20.2 53.69,15.63 53.21,15.16 52.08,15.16
$1N75: length 1.9
  Top Layer w0.762: 37.76,10.15 35.95,10.15 35.9,10.2
$1N2212: length 8.5
  Top Layer w0.254: P4.4 P4.3
  Bottom Layer w0.254: 45.3,24.17 45.05,24.42 41.4,24.42 40.18,25.64 P4.4

## Copper pours and planes (outline as drawn; the poured copper is in the pictures)
GND on Top Layer: 46.78,27.27 50.49,27.27 50.54,27.22 50.54,25.33 50.34,25.54 49.07,25.54 48.97,25.44 48.97,21.68 47.8,21.68 47.7,21.78 47.7,25.03 47.64,25.08 46.83,25.08
GND on Top Layer: 38.86,8.42 48.3,8.42 48.36,8.37 48.36,0.44 47.95,0.04 39.01,0.04 38.91,-0.06 38.91,8.32 38.86,8.37
GND on Top Layer: 60.4,14.67 60.4,9.64 55.06,9.64 55.11,14.72 60.34,14.72
GND on Top Layer: 60.45,19.8 60.5,19.75 60.5,16.09 55.16,16.09 55.16,19.8
GND on Top Layer: 15.13,12.28 15.13,8.67 15.23,8.57 21.58,8.57 21.64,8.52 21.64,12.23 21.58,12.28
GND on Top Layer: 15.39,18.48 20.87,18.48 20.97,18.38 20.97,14.01 20.87,13.91 15.54,13.91 15.39,14.06 15.44,14.06
GND on Bottom Layer: -1.43,-4.59 -1.43,29.96 77.21,29.96 77.82,30.57 77.82,-3.62 78.73,-4.53 -1.38,-4.53
GND on Inner1: -0.87,30.97 -0.87,-1.64 0.05,-2.55 74.82,-2.55 74.87,-2.61 74.87,31.79 74.98,31.89 -1.07,31.89 -1.12,31.94
L_A on Top Layer: 11.78,-0.42 11.78,7.35 13.25,8.83 14.22,8.83 14.22,13.75 14.17,13.8 -0.26,13.8 -0.26,-0.63
L_B on Top Layer: 11.53,29.55 11.58,29.5 11.58,22.13 11.68,22.03 11.68,20.15 11.83,20 14.47,20 14.47,17.26 14.42,17.21 14.42,14.57 14.37,14.62 -0.36,14.62 -0.36,28.54
R_A on Top Layer: 63.8,28.23 63.85,28.18 63.85,21.37 62.02,19.54 61.11,19.54 61.16,14.62 61.21,14.57 74.06,14.57 75.94,16.44 75.94,28.59
R_B on Top Layer: 63.85,-0.27 63.8,-0.22 63.8,5.57 63.75,5.62 63.75,8.01 63.49,8.27 61.06,8.27 61.06,13.19 61.16,13.3 61.51,13.5 65.12,13.55 68.73,13.55 72.54,13.6 76.3,13.3 76.3,-0.22
VM on Top Layer: 12.8,28.74 12.75,28.69 12.75,21.93 12.8,21.88 16.45,21.88 16.86,21.47 21.53,21.47 21.79,21.73 21.79,27.98
VM on Top Layer: 49.52,5.83 50.03,6.39 62.33,6.39 62.63,6.08 62.63,0.04 62.53,-0.06 49.73,-0.06 49.68,-0.12 49.02,-0.12 48.76,0.14 48.76,5.07
VM on Top Layer: 51.76,28.94 51.76,23.1 53.44,21.42 57.86,21.42 58.41,21.98 62.48,21.98 62.63,22.13 62.63,28.74 62.48,28.89
VM on Top Layer: 37.43,-0.17 37.94,0.19 38.3,0.55 38.3,7.5 37.94,7.86 37.84,7.86 37.33,8.37 33.12,8.37 32.81,8.06 32.81,4.66 32.25,4 32.81,-0.01 32.51,-0.32 35.1,-0.12
VM on Top Layer: 12.69,-1.34 13.1,6.54 21.89,6.54 21.89,5.52 20.77,5.52 20.52,5.27 20.52,2.63 20.62,2.53 20.62,2.47 20.92,2.17 27.43,2.17 27.83,2.58 27.83,3.69 28.14,4 33.88,4 35.3,5.42 35.76,5.83 36.98,5.83 37.64,5.17 37.69,-1.08 37.79,-1.18 12.85,-1.18
VM on Inner2: 77.36,-3.16 75.23,-5.3 0.4,-5.3 -1.22,-3.67 -1.22,37.12 75.13,37.12 77.36,34.89

Small or netless copper shapes (teardrops, artwork), in the pictures only: 170 on Top Layer, 14 on Bottom Layer

## Text on the board
Top Layer: 山东工商学院 / 2025-5-31 / 银河战舰队
Top Solder Mask Layer: 山东工商学院 / 2025-5-31 / 银河战舰队
Top Silkscreen Layer: LPWM | RPWM | + | -
